# Altium schematic sheet fpga-bank7.SchDoc: FPGA - Bank 7
size Letter; CheckedBy: E. Chiu; CompanyName: Brinton Engineering, LLC; DrawnBy: J. Brinton; Engineer: J. Brinton; Address1: 3479 Edison Way; Address2: Menlo Park CA 94025; Address3: +1 (877) 778-8435; Address4: brintonengineering.com; Revision: 1; SheetNumber: 14; SheetTotal: 48
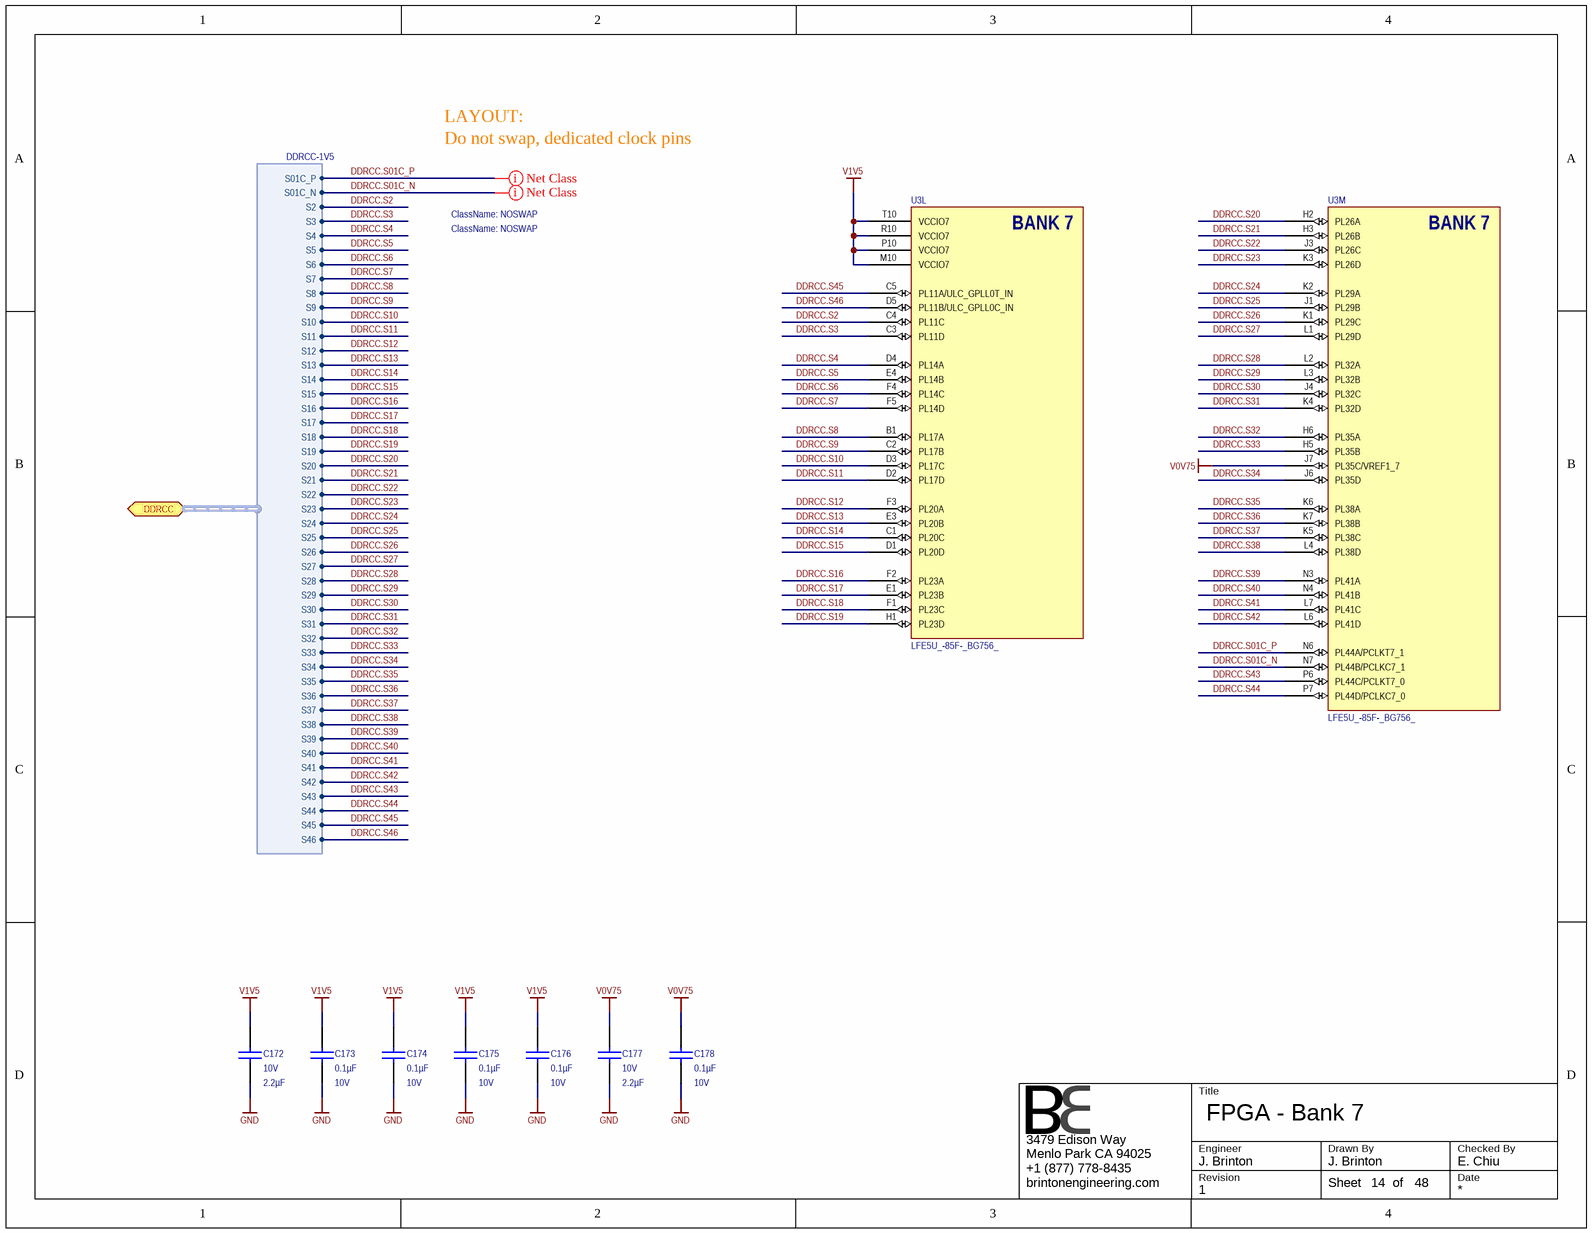
[diagram p0: fpga-bank7.SchDoc]

## Parts
C172  Voltage - Rated: 10V  Capacitance: 2.2µF  [CAPC1608X90N]  (hidden comment: GRM188R71A225KE15D)
C173  Capacitance: 0.1µF  Voltage - Rated: 10V  [CAPC1005X56N]  (hidden comment: GRM155R71A104KA01J)
C174  Capacitance: 0.1µF  Voltage - Rated: 10V  [CAPC1005X56N]  (hidden comment: GRM155R71A104KA01J)
C175  Capacitance: 0.1µF  Voltage - Rated: 10V  [CAPC1005X56N]  (hidden comment: GRM155R71A104KA01J)
C176  Capacitance: 0.1µF  Voltage - Rated: 10V  [CAPC1005X56N]  (hidden comment: GRM155R71A104KA01J)
C177  Voltage - Rated: 10V  Capacitance: 2.2µF  [CAPC1608X90N]  (hidden comment: GRM188R71A225KE15D)
C178  Capacitance: 0.1µF  Voltage - Rated: 10V  [CAPC1005X56N]  (hidden comment: GRM155R71A104KA01J)
U3  LFE5U_-85F-_BG756_  [caBGA756]  (parts L,M of 19)

## Ports
DDRCC (harness DDRCC-1V5)

## Harnesses
DDRCC-1V5: S01C_P, S01C_N, S2, S3, S4, S5, S6, S7, S8, S9, S10, S11, S12, S13, S14, S15, S16, S17, S18, S19, S20, S21, S22, S23, S24, S25, S26, S27, S28, S29, S30, S31, S32, S33, S34, S35, S36, S37, S38, S39, S40, S41, S42, S43, S44, S45, S46

## Nets
GND: C172.1 C173.1 C174.1 C175.1 C176.1 C177.1 C178.1
V0V75: C177.2 C178.2 U3.J7(PL35C/VREF1_7)
V1V5: C172.2 C173.2 C174.2 C175.2 C176.2 U3.M10(VCCIO7) U3.P10(VCCIO7) U3.R10(VCCIO7) U3.T10(VCCIO7)
DDRCC.S01C_N: U3.N7(PL44B/PCLKC7_1) ; port DDRCC.S01C_N
DDRCC.S01C_P: U3.N6(PL44A/PCLKT7_1) ; port DDRCC.S01C_P
DDRCC.S2: U3.C4(PL11C) ; port DDRCC.S2
DDRCC.S3: U3.C3(PL11D) ; port DDRCC.S3
DDRCC.S4: U3.D4(PL14A) ; port DDRCC.S4
DDRCC.S5: U3.E4(PL14B) ; port DDRCC.S5
DDRCC.S6: U3.F4(PL14C) ; port DDRCC.S6
DDRCC.S7: U3.F5(PL14D) ; port DDRCC.S7
DDRCC.S8: U3.B1(PL17A) ; port DDRCC.S8
DDRCC.S9: U3.C2(PL17B) ; port DDRCC.S9
DDRCC.S10: U3.D3(PL17C) ; port DDRCC.S10
DDRCC.S11: U3.D2(PL17D) ; port DDRCC.S11
DDRCC.S12: U3.F3(PL20A) ; port DDRCC.S12
DDRCC.S13: U3.E3(PL20B) ; port DDRCC.S13
DDRCC.S14: U3.C1(PL20C) ; port DDRCC.S14
DDRCC.S15: U3.D1(PL20D) ; port DDRCC.S15
DDRCC.S16: U3.F2(PL23A) ; port DDRCC.S16
DDRCC.S17: U3.E1(PL23B) ; port DDRCC.S17
DDRCC.S18: U3.F1(PL23C) ; port DDRCC.S18
DDRCC.S19: U3.H1(PL23D) ; port DDRCC.S19
DDRCC.S20: U3.H2(PL26A) ; port DDRCC.S20
DDRCC.S21: U3.H3(PL26B) ; port DDRCC.S21
DDRCC.S22: U3.J3(PL26C) ; port DDRCC.S22
DDRCC.S23: U3.K3(PL26D) ; port DDRCC.S23
DDRCC.S24: U3.K2(PL29A) ; port DDRCC.S24
DDRCC.S25: U3.J1(PL29B) ; port DDRCC.S25
DDRCC.S26: U3.K1(PL29C) ; port DDRCC.S26
DDRCC.S27: U3.L1(PL29D) ; port DDRCC.S27
DDRCC.S28: U3.L2(PL32A) ; port DDRCC.S28
DDRCC.S29: U3.L3(PL32B) ; port DDRCC.S29
DDRCC.S30: U3.J4(PL32C) ; port DDRCC.S30
DDRCC.S31: U3.K4(PL32D) ; port DDRCC.S31
DDRCC.S32: U3.H6(PL35A) ; port DDRCC.S32
DDRCC.S33: U3.H5(PL35B) ; port DDRCC.S33
DDRCC.S34: U3.J6(PL35D) ; port DDRCC.S34
DDRCC.S35: U3.K6(PL38A) ; port DDRCC.S35
DDRCC.S36: U3.K7(PL38B) ; port DDRCC.S36
DDRCC.S37: U3.K5(PL38C) ; port DDRCC.S37
DDRCC.S38: U3.L4(PL38D) ; port DDRCC.S38
DDRCC.S39: U3.N3(PL41A) ; port DDRCC.S39
DDRCC.S40: U3.N4(PL41B) ; port DDRCC.S40
DDRCC.S41: U3.L7(PL41C) ; port DDRCC.S41
DDRCC.S42: U3.L6(PL41D) ; port DDRCC.S42
DDRCC.S43: U3.P6(PL44C/PCLKT7_0) ; port DDRCC.S43
DDRCC.S44: U3.P7(PL44D/PCLKC7_0) ; port DDRCC.S44
DDRCC.S45: U3.C5(PL11A/ULC_GPLL0T_IN) ; port DDRCC.S45
DDRCC.S46: U3.D5(PL11B/ULC_GPLL0C_IN) ; port DDRCC.S46

## Layout directives
net class NOSWAP: DDRCC.S01C_N, DDRCC.S01C_P

## Notes on the sheet
- Do not swap, dedicated clock pins
- LAYOUT:
- Title
- Engineer
- Revision
- Drawn By
- Checked By
- Date
- Sheet
- of
- (in symbol LFE5U_-85F-_BG756_, part L) BANK 7
- (in symbol LFE5U_-85F-_BG756_, part M) BANK 7

## Library data of the parts
C172 C177 = GRM188R71A225KE15D: CAP CER 2.2UF 10V 10% X7R 0603; Manufacturer: Murata Electronics North America; Manufacturer P/N: GRM188R71A225KE15D; Operating Temperature: -55°C ~ 125°C; Thickness (Max): 0.035" (0.90mm); Tolerance: ±10%; Package / Case: 0603 (1608 Metric); Temperature Coefficient: X7R; Supplier 1: Newark; Supplier 2: Digi-Key; RoHS: RoHS Compliant; Size / Dimension: 0.063" L x 0.031" W (1.60mm x 0.80mm); Mounting Type: Surface Mount, MLCC; ComponentLink1URL: http://www.murata.com/~/media/webrenewal/support/library/catalog/products/capacitor/mlcc/c02e.ashx; ComponentLink1Description: http://www.murata.com/~/media/webrenewal/support/library/catalog/products/capacitor/mlcc/c02e.ashx; Supplier Part Number 1: 72R4209; Supplier Part Number 2: 490-4520-1-ND
C173-C176 C178 = GRM155R71A104KA01J: CAP CER 0.1UF 10V 10% X7R 0402; Manufacturer: Murata Electronics North America; Manufacturer P/N: GRM155R71A104KA01J; Operating Temperature: -55°C ~ 125°C; Thickness (Max): 0.022" (0.55mm); Size / Dimension: 0.039" L x 0.020" W (1.00mm x 0.50mm); RoHS: RoHS Compliant; Mounting Type: Surface Mount, MLCC; Supplier 1: Digi-Key; ComponentLink1URL: http://www.murata.com/~/media/webrenewal/support/library/catalog/products/capacitor/mlcc/c02e.ashx; ComponentLink1Description: http://www.murata.com/~/media/webrenewal/support/library/catalog/products/capacitor/mlcc/c02e.ashx; Supplier Part Number 1: 490-6322-1-ND; Temperature Coefficient: X7R; Package / Case: 0402 (1005 Metric); Tolerance: ±10%
U3 = LFE5U_-85F-_BG756_: ECP5 FPGA, 85k LUT, 756-caBGA; Manufacturer: Lattice Semiconductor; Manufacturer P/N: LFE5U_-85F-_BG756_